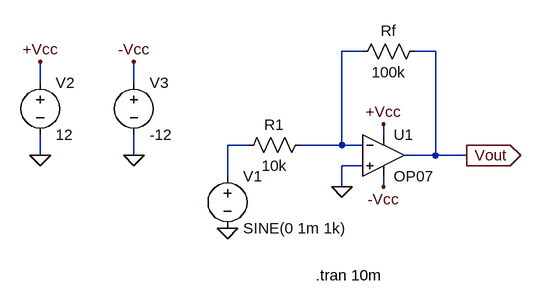
[diagram p0: schematic inv_amp.asc]
inv_amp.asc, the LTspice schematic file:
Version 4
SHEET 1 880 680
WIRE 384 144 352 144
WIRE 496 144 464 144
WIRE -112 192 -112 160
WIRE 32 192 32 160
WIRE 416 272 416 256
WIRE 208 288 176 288
WIRE 352 288 352 144
WIRE 352 288 288 288
WIRE 384 288 352 288
WIRE -112 304 -112 272
WIRE 32 304 32 272
WIRE 496 304 496 144
WIRE 496 304 448 304
WIRE 544 304 496 304
WIRE 384 320 352 320
WIRE 176 336 176 288
WIRE 352 352 352 320
WIRE 416 352 416 336
FLAG -112 304 0
FLAG 32 304 0
FLAG 544 304 Vout
IOPIN 544 304 Out
FLAG -112 160 +Vcc
FLAG 32 160 -Vcc
FLAG 416 256 +Vcc
FLAG 416 352 -Vcc
FLAG 176 416 0
FLAG 352 352 0
SYMBOL OP07 416 240 R0
SYMATTR InstName U1
SYMBOL voltage 176 320 R0
SYMATTR InstName V1
SYMATTR Value SINE(0 1m 1k)
SYMBOL voltage -112 176 R0
SYMATTR InstName V2
SYMATTR Value 12
SYMBOL voltage 32 176 R0
SYMATTR InstName V3
SYMATTR Value -12
SYMBOL res 304 272 R90
WINDOW 0 0 56 VBottom 2
WINDOW 3 32 56 VTop 2
SYMATTR InstName R1
SYMATTR Value 10k
SYMBOL res 480 128 R90
WINDOW 0 0 56 VBottom 2
WINDOW 3 32 56 VTop 2
SYMATTR InstName Rf
SYMATTR Value 100k
TEXT 312 488 Left 2 !.tran 10m

The netlist it stands for:
* inv_amp.asc
XU1 0 N001 +Vcc -Vcc Vout LT1001  ; OP07, pins In+ In- V+ V- OUT
V1 N002 0 SINE(0 1m 1k)
V2 +Vcc 0 12
V3 -Vcc 0 -12
R1 N001 N002 10k
Rf Vout N001 100k
.tran 10m
.lib LTC.lib
.backanno
.end